# Altium schematic sheet PE_CAM_EZ_Bridge.SchDoc
size A3
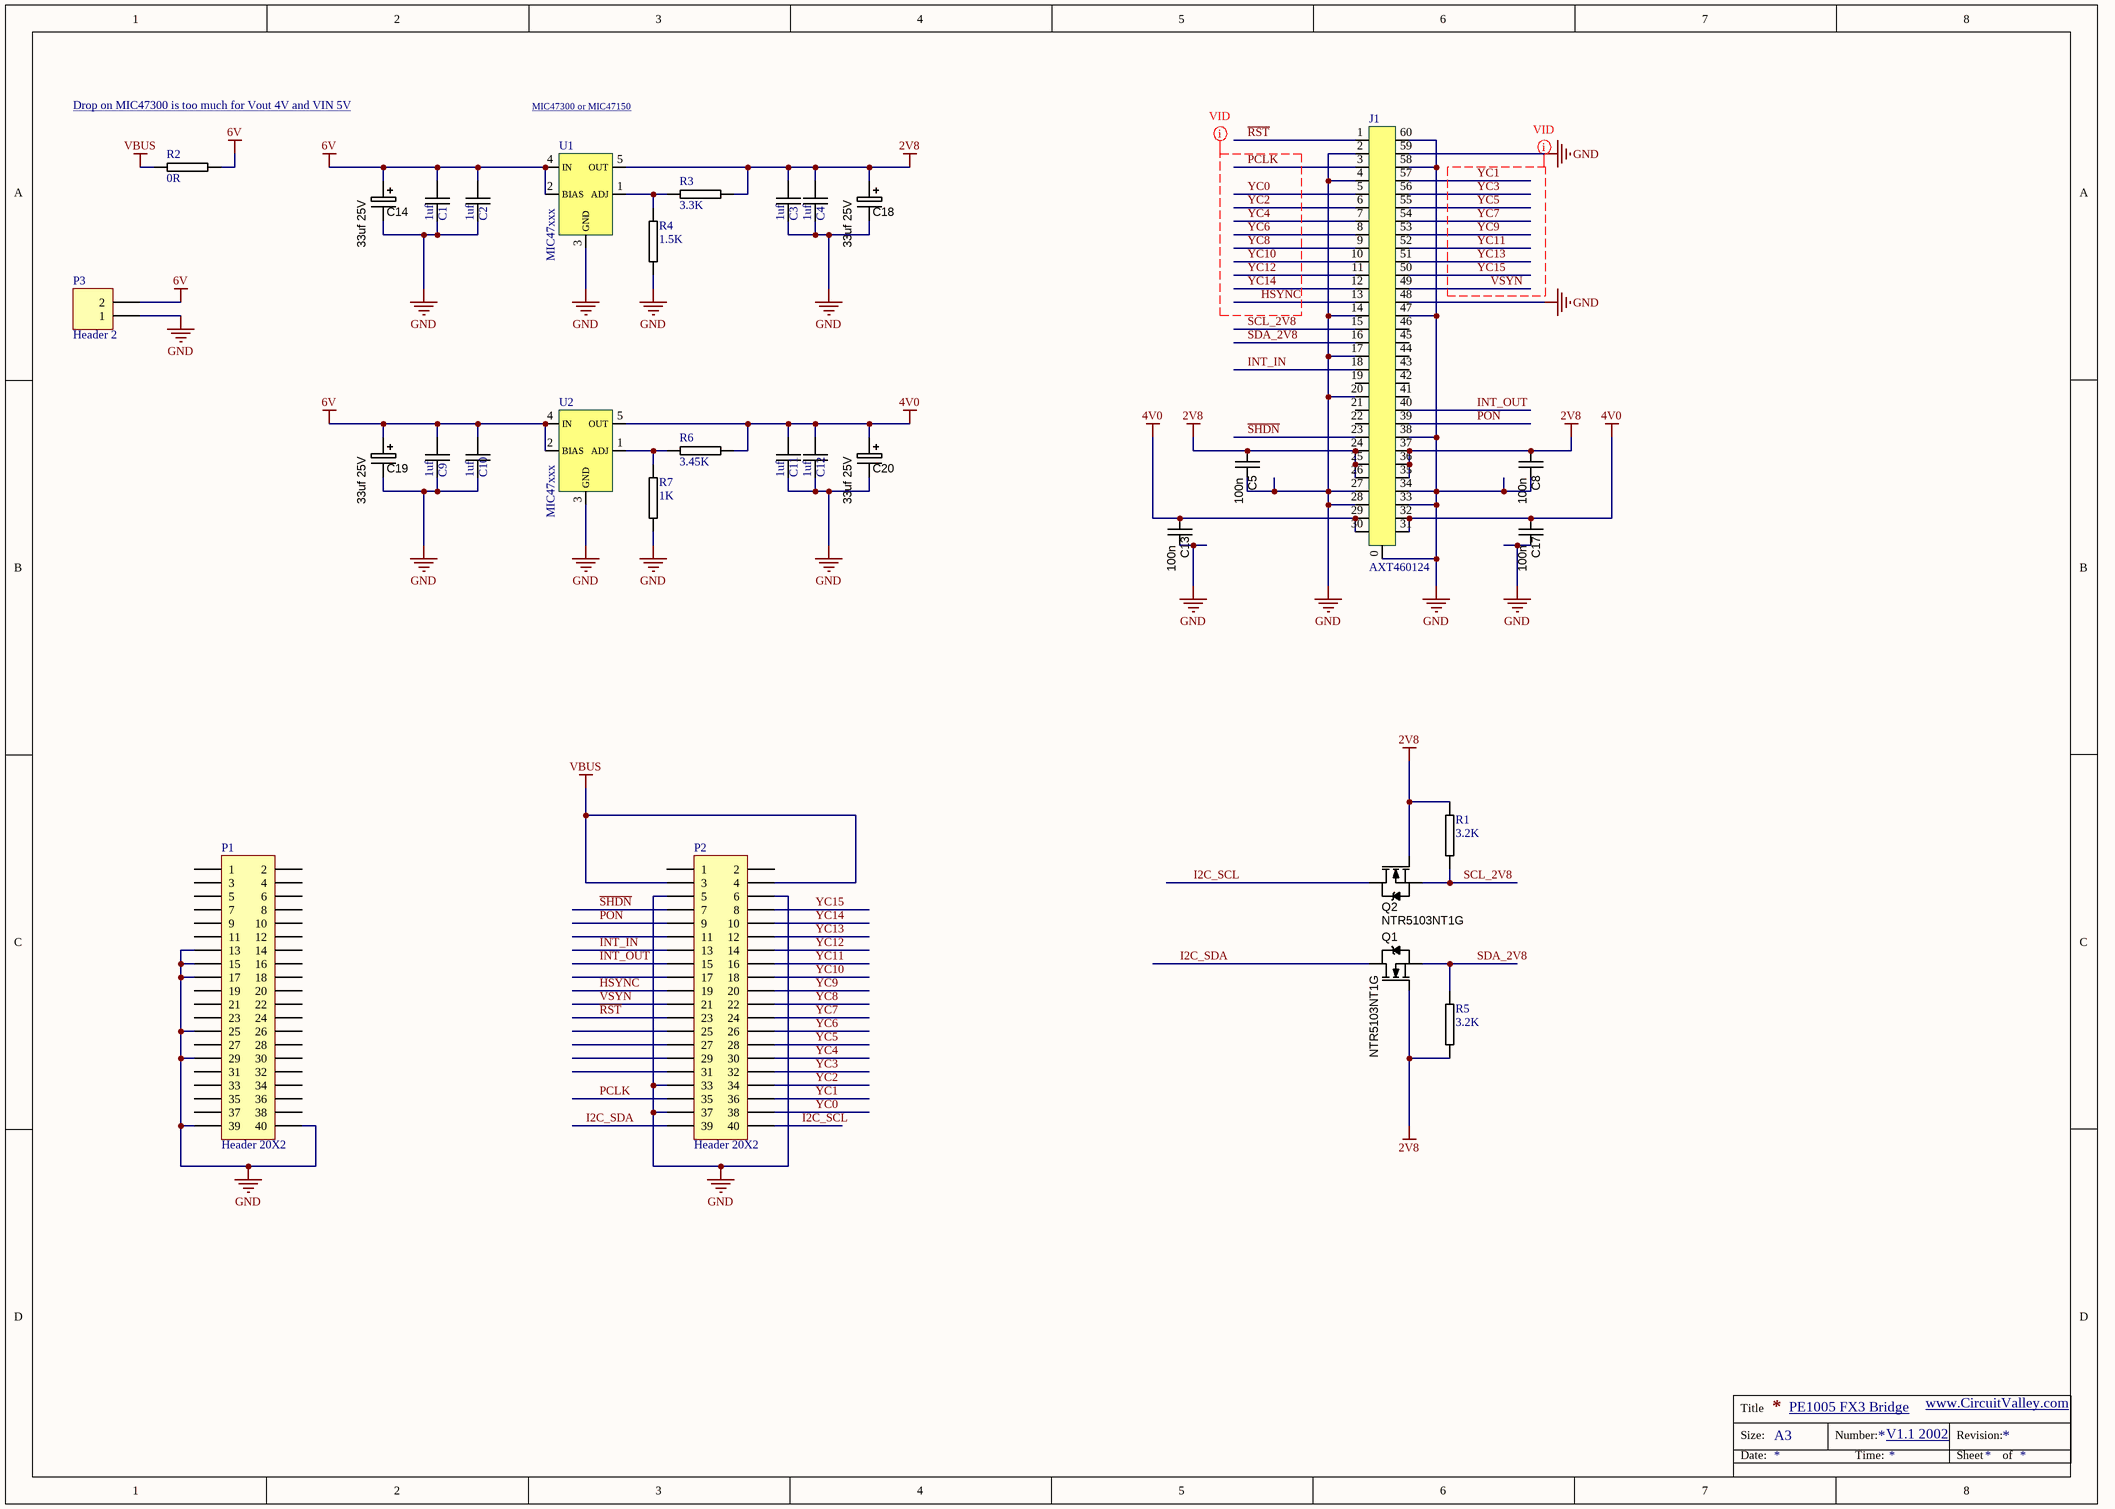
[diagram p0: PE_CAM_EZ_Bridge.SchDoc]

## Parts
C1  1uf  [0805C-TBD]
C2  1uf  [0805C-TBD]
C3  1uf  [0805C-TBD]
C4  1uf  [0805C-TBD]
C5  100n  [CAPC1608N]
C8  100n  [CAPC1608N]
C9  1uf  [0805C-TBD]
C10  1uf  [0805C-TBD]
C11  1uf  [0805C-TBD]
C12  1uf  [0805C-TBD]
C13  100n  [CAPC1608N]
C14  value 33uf 25V  [CAPMP7343X310N]  (hidden comment: 33uf 20V D)
C17  100n  [CAPC1608N]
C18  value 33uf 25V  [CAPMP7343X310N]  (hidden comment: 33uf 20V D)
C19  value 33uf 25V  [CAPMP7343X310N]  (hidden comment: 33uf 20V D)
C20  value 33uf 25V  [CAPMP7343X310N]  (hidden comment: 33uf 20V D)
J1  AXT460124  [AXT460124]
P1  Header 20X2  [HDR2X20]
P2  Header 20X2  [HDR2X20]
P3  Header 2  [HDR1X2]
Q1  NTR5103NT1G  [SOT23-3]
Q2  NTR5103NT1G  [SOT23-3]
R1  3.2K  [0805R-5K6]
R2  0R  [0805R-5K6]
R3  3.3K  [0805R-5K6]
R4  1.5K  [0805R-5K6]
R5  3.2K  [0805R-5K6]
R6  3.45K  [0805R-5K6]
R7  1K  [0805R-5K6]
U1  MIC47xxx  [TO-252-5 DPAK 5]
U2  MIC47xxx  [TO-252-5 DPAK 5]

## Nets
2V8: C3.1 C4.1 C5.1 C8.1 C18.1 J1.24 J1.25 J1.26 J1.35 J1.36 J1.37 Q1.1(G) Q2.1(G) R1.1 R3.2 R5.2 U1.5(OUT)
4V0: C11.1 C12.1 C13.1 C17.1 C20.1 J1.29 J1.30 J1.31 J1.32 R6.2 U2.5(OUT)
6V: C1.1 C2.1 C9.1 C10.1 C14.1 C19.1 P3.2 R2.2 U1.2(BIAS) U1.4(IN) U2.2(BIAS) U2.4(IN)
GND: C1.2 C2.2 C3.2 C4.2 C5.2 C8.2 C9.2 C10.2 C11.2 C12.2 C13.2 C14.2 C17.2 C18.2 C19.2 C20.2 J1.0 J1.2 J1.4 J1.14 J1.17 J1.20 J1.27 J1.28 J1.33 J1.34 J1.38 J1.47 J1.48 J1.58 J1.59 J1.60 P1.13 P1.15 P1.17 P1.25 P1.29 P1.39 P1.40 P2.5 P2.6 P2.33 P2.37 P3.1 R4.2 R7.2 U1.3(GND) U2.3(GND)
VBUS: P2.3 P2.4 R2.1
HSYNC: J1.13 P2.19
I2C_SCL: P2.40 Q2.3(D)
I2C_SDA: P2.39 Q1.3(D)
INT_IN: J1.18 P2.13
INT_OUT: J1.40 P2.15
PCLK: J1.3 P2.35
PON: J1.39 P2.9
~{RST}: J1.1 P2.23
~{SHDN}: J1.23 P2.7
SCL_2V8: J1.15 Q2.2(S) R1.2
SDA_2V8: J1.16 Q1.2(S) R5.1
VSYN: J1.49 P2.21
YC0: J1.5 P2.38
YC1: J1.57 P2.36
YC2: J1.6 P2.34
YC3: J1.56 P2.32
YC4: J1.7 P2.30
YC5: J1.55 P2.28
YC6: J1.8 P2.26
YC7: J1.54 P2.24
YC8: J1.9 P2.22
YC9: J1.53 P2.20
YC10: J1.10 P2.18
YC11: J1.52 P2.16
YC12: J1.11 P2.14
YC13: J1.51 P2.12
YC14: J1.12 P2.10
YC15: J1.50 P2.8
NetR3_1: R3.1 R4.1 U1.1(ADJ)
NetR6_1: R6.1 R7.1 U2.1(ADJ)

Not connected (* = marked no-connect by the designer): J1 19(80) 21(82) 22(83) 41(102) 42(103) 43(104) 44(105) 45(106) 46(107); P1 1 2 3 4 5 6 7 8 9 10 11 12 14 16 18 19 20 21 22 23 24 26 27 28 30 31 32 33 34 35 36 37 38; P2 1 2 11 17 25 27 29 31

## Layout directives
net class VID: HSYNC, PCLK, VSYN, YC0, YC1, YC2, YC3, YC4, YC5, YC6, YC7, YC8, YC9, YC10, YC11, YC12, YC13, YC14, YC15

## Notes on the sheet
- Drop on MIC47300 is too much for Vout 4V and VIN 5V
- MIC47300 or MIC47150
- PE1005 FX3 Bridge
- V1.1 2002
- www.CircuitValley.com
- Title
- Size:
- Date:
- A3
- Number:
- Time:
- Revision:
- Sheet
- of

## Library data of the parts
C1-C4 C9-C12 = 0805C-TBD: CAPACITOR 0805 CERAMIC VALUE TO BE DETERMINED
C5 C8 C13 C17 = CAPC_10p_0603_NP0_1%_50V: Capacitor SMD Cer 10pF 5% 50V NP0 0603; Manufacturer 1: Murata Electronics North America; Manufacturer Part Number 1: GRM1885C1H100FA01J; Part: C0603X104K5RAC; Ratings: 50V; NP0; Tolerance: ±5%; Operating Temperature: -55°C ~ 125°C; Package / Case: 0603 (1608 Metric); Size / Dimension: 0.063" L x 0.032" W (1.60mm x 0.81mm); Thickness (Max): 0.035" (0.90mm); Supplier 1: Digi-Key; Supplier Part Number 1: GRM1885C1H100FA01J-ND; Value: 100n
C14 C18-C20 = CAPT_330u_2917_6V3: Capacitor SMD Tant 330uF 20% 6V3 2917; Manufacturer Part Number: T520D337M006ATE015; Part: TAJD336K020R; Ratings: 6.3V; Material: Solid Tantalum; ESR (Equivalent Series Resistance): 15 mOhm; Package / Case: 2917 (7343 Metric); Tolerance: ±20%; Operating Temperature: -55°C ~ 125°C; Size / Dimension: 0.287" L x 0.169" W (7.30mm x 4.30mm); Height - Seated (Max): 0.122" (3.10mm); Manufacturer Size Code: D; Supplier 1: Digi-Key; Supplier Part Number 1: 399-4052-1-ND; ComponentLink1URL: http://www.kemet.com/datasheets&T520D337M006ATE015; ComponentLink1Description: T520D Datasheet
J1 = Connector 60 Pin
P1 P2 = Header 20X2: Header, 20-Pin, Dual row; LatestRevisionDate: 17-Jul-2002; LatestRevisionNote: Re-released for DXP Platform.; Publisher: Altium Limited
P3 = Header 2: Header, 2-Pin; LatestRevisionDate: 17-Jul-2002; LatestRevisionNote: Re-released for DXP Platform.; Publisher: Altium Limited
Q1 Q2 = MOSFET_BSS123: MOSFET SMD N-CH 100V 170mA SOT23-3; Manufacturer 1: Diodes Inc; Manufacturer Part Number 1: BSS123-7-F; Ratings: 100V; 170mA; Material: Metal Oxide; Package / Case: SOT23-3; Supplier 1: Digi-Key; Supplier Part Number 1: BSS123-FDICT-ND
R1-R7 = 0805R-5K6: RESISTOR 0805 1/4 WATT THIN FILM; Part: RC0805FR-075K6L; Reel: *
U1 U2 = MIC47xxx: MIC47xxx Regulator